# Altium project YuzukiNeko.PrjPcb
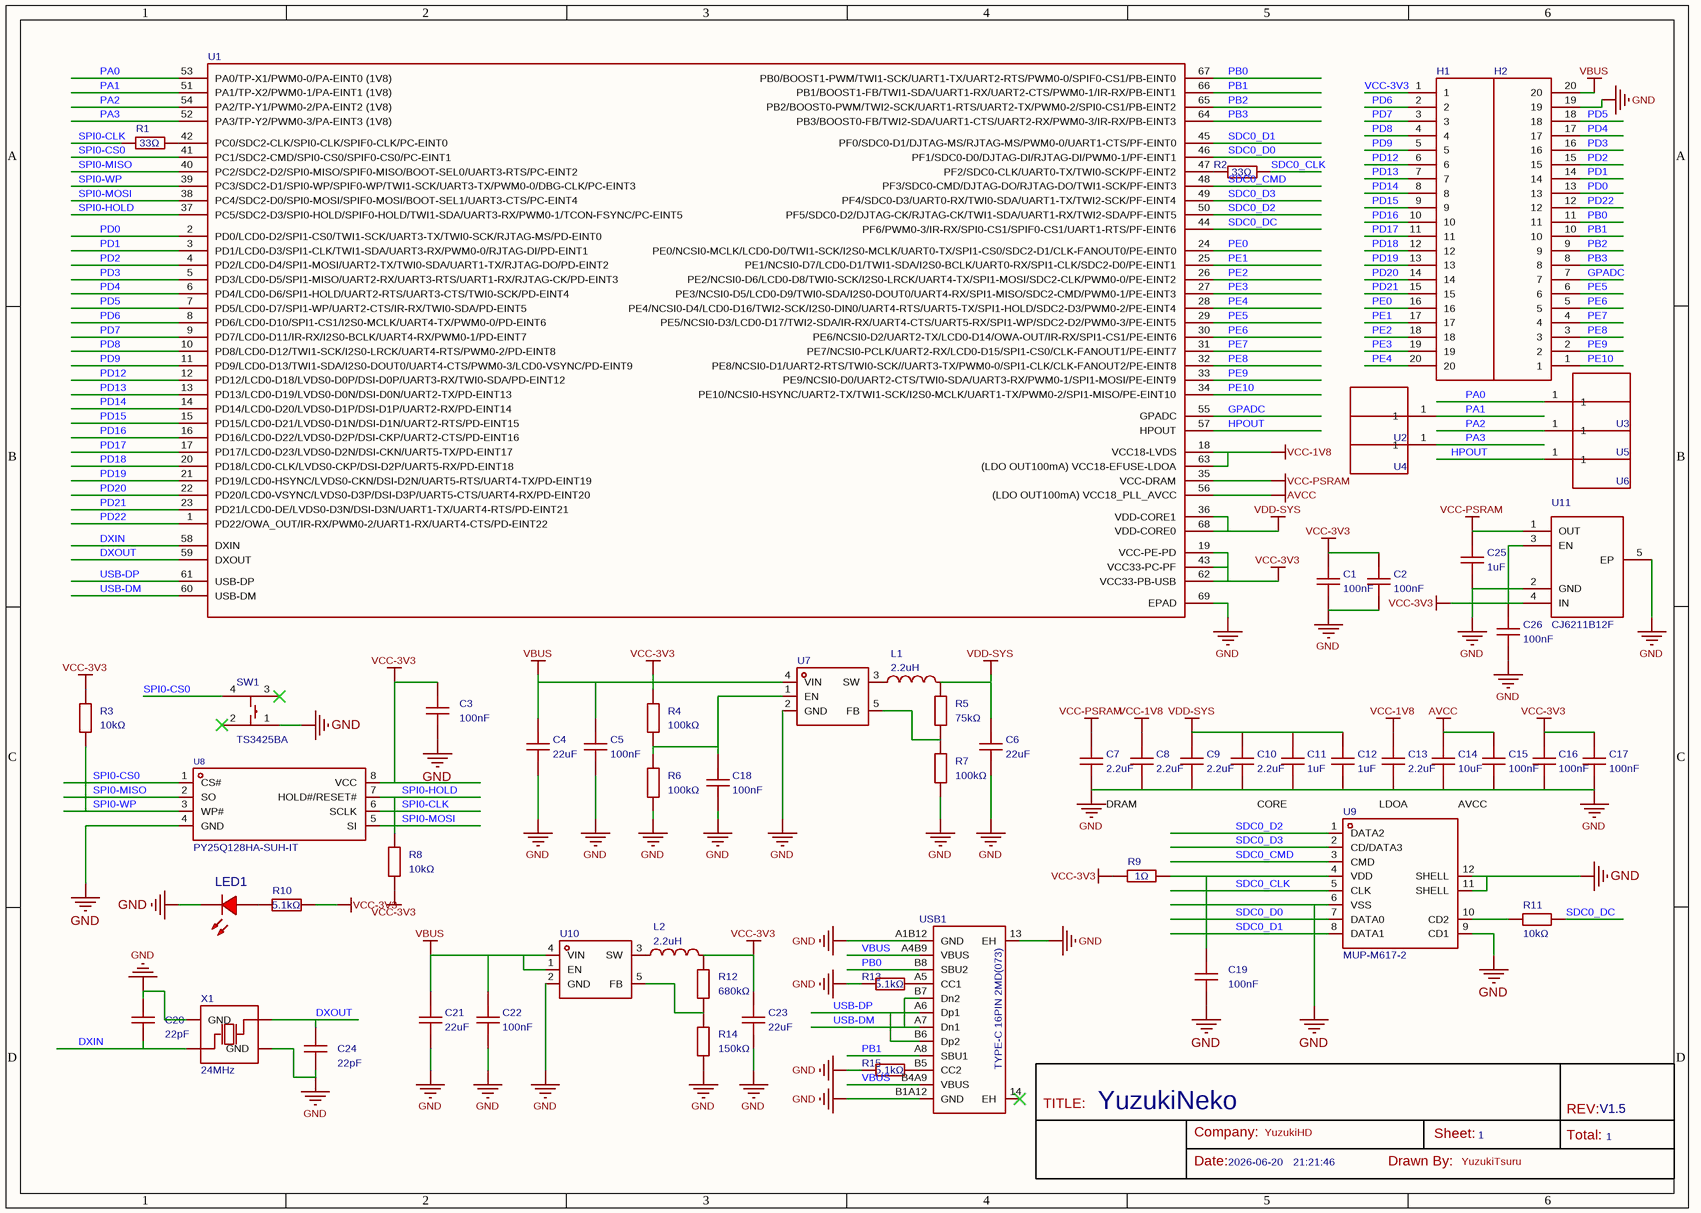
[diagram p0: P1.schdoc]
1 sheet, 60 parts. Net scope: global (net labels, ports and power ports of the same name join across sheets).
Board file: PCB1.pcbdoc

## Sheet P1.schdoc
size 297 x 212 mm; Symbol: Sheet_A4; Company: 嘉立创EDA; Version: V1.5; Page Size: A4; @Project Name: YuzukiNeko; @Update Date: 2026-06-20; @Create Date: 2026-04-19; Color: #000000; @Page Name: P1; @Page Count: 1; @Page No: 1; @Update Time: 21:21:46; Device: Sheet_A4; @Board Name: Board1; @Create Time: 20:09:08; @Schematic Name: Schematic1; @Assembly Variant: Basic; Border: 1; Title Block Position: 3; Size: A4; Width: 1170; Height: 825; Region Start: 1; X Region Count: 6; Y Region Count: 4; Blade Width: 10

### Parts
C1  100nF  [C0402-NSK]
C2  100nF  [C0402-NSK]
C3  100nF  [C0402-NSK]
C4  22uF  [C0603-NSK]
C5  100nF  [C0603-NSK]
C6  22uF  [C0603-NSK]
C7  2.2uF  [C0402-NSK]
C8  2.2uF  [C0402-NSK]
C9  2.2uF  [C0402-NSK]
C10  2.2uF  [C0402-NSK]
C11  1uF  [C0402-NSK]
C12  1uF  [C0402-NSK]
C13  2.2uF  [C0402-NSK]
C14  10uF  [C0402-NSK]
C15  100nF  [C0402-NSK]
C16  100nF  [C0402-NSK]
C17  100nF  [C0402-NSK]
C18  100nF  [C0603-NSK]
C19  100nF  [C0402-NSK]
C20  22pF  [C0402-NSK]
C21  22uF  [C0603-NSK]
C22  100nF  [C0603-NSK]
C23  22uF  [C0603-NSK]
C24  22pF  [C0402-NSK]
C25  1uF  [C0402-NSK]
C26  100nF  [C0402-NSK]
H1  (no value)  [2.54PHSM-1X20P]
H2  (no value)  [2.54PHSM-1X20P]
L1  value 2.2uH  [IND-SMD_L2.0-W1.6_1]
L2  value 2.2uH  [IND-SMD_L2.0-W1.6_1]
LED1  (no value)  [LED0603 NSK]
R1  33Ω  [R0402-NSK]
R2  33Ω  [R0402-NSK]
R3  10kΩ  [R0402-NSK]
R4  100kΩ  [R0402-NSK]
R5  75kΩ  [R0402-NSK]
R6  100kΩ  [R0402-NSK]
R7  100kΩ  [R0402-NSK]
R8  10kΩ  [R0402-NSK]
R9  1Ω  [R0402-NSK]
R10  5.1kΩ  [R0402-NSK]
R11  10kΩ  [R0402-NSK]
R12  680kΩ  [R0402-NSK]
R13  5.1kΩ  [R0402-NSK]
R14  150kΩ  [R0402-NSK]
R15  5.1kΩ  [R0402-NSK]
SW1  TS3425BA  [SW-SMD_4P-L4.2-W3.2-P2.15-LS4.6-1]
U1  (no value)  [QFN-68_L7.0-W7.0-P0.35-TL-EP4.5]
U2  (no value)  [PAD60]
U3  (no value)  [PAD60]
U4  (no value)  [PAD60]
U5  (no value)  [PAD60]
U6  (no value)  [PAD60]
U7  (no value)  [SOT-23-5_L3.0-W1.7-P0.95-LS2.8-BR]
U8  PY25Q128HA-SUH-IT  [SOP-8_L5.2-W5.3-P1.27-LS7.9-BL]
U9  MUP-M617-2  [TF-SMD_MUP-M617-2]
U10  (no value)  [SOT-23-5_L3.0-W1.7-P0.95-LS2.8-BR]
U11  CJ6211B12F  [UDFN-4_L1.0-W1.0-P0.65-BL-EP]
USB1  TYPE-C 16PIN 2MD(073)  [USB-C-SMD_TYPE-C-16PIN-2MD-073]
X1  24MHz  [osc-smd_4p-l2.0-w1.6-bl]

### Nets
AVCC: C14.2 C15.2 U1.56((LDO_OUT100mA)_VCC18_PLL_AVCC)
GND: C1.1 C2.1 C3.2 C4.1 C5.1 C6.1 C7.1 C8.1 C9.1 C10.1 C11.1 C12.1 C13.1 C14.1 C15.1 C16.1 C17.1 C18.1 C19.1 C20.2 C21.1 C22.1 C23.1 C24.1 C25.1 C26.1 H2.19 LED1.1(C) R6.1 R7.1 R13.1 R14.1 R15.1 SW1.1 U1.69(EPAD) U7.2(GND) U8.4(GND) U9.6(VSS) U9.9(CD1) U9.11(SHELL) U9.12(SHELL) U10.2(GND) U11.2(GND) U11.5(EP) USB1.13(EH) USB1.A1B12(GND) USB1.B1A12(GND) X1.2(GND) X1.4(GND)
VBUS: C4.2 C5.2 C21.2 C22.2 H2.20 U7.4(VIN) U10.1(EN) U10.4(VIN) USB1.A4B9(VBUS) USB1.B4A9(VBUS)
VCC-1V8: C8.2 C13.2 U1.18(VCC18-LVDS) U1.63((LDO_OUT100mA)_VCC18-EFUSE-LDOA)
VCC-3V3: C1.2 C2.2 C3.1 C16.2 C17.2 C23.2 C26.2 H1.1 L2.2 R3.2 R4.2 R8.1 R9.2 R10.2 R12.2 U1.19(VCC-PE-PD) U1.43(VCC33-PC-PF) U1.62(VCC33-PB-USB) U8.8(VCC) U11.3(EN) U11.4(IN)
VCC-PSRAM: C7.2 C25.2 U1.35(VCC-DRAM) U11.1(OUT)
VDD-SYS: C6.2 C9.2 C10.2 C11.2 C12.2 L1.2 R5.2 U1.36(VDD-CORE1) U1.68(VDD-CORE0)
DXIN: C20.1 U1.58(DXIN) X1.1(OSC1)
DXOUT: C24.2 U1.59(DXOUT) X1.3(OSC2)
GPADC: H2.7 U1.55(GPADC)
HPOUT: U1.57(HPOUT) U6.1
PA0: U1.53(PA0/TP-X1/PWM0-0/PA-EINT0_(1V8)) U3.1
PA1: U1.51(PA1/TP-X2/PWM0-1/PA-EINT1_(1V8)) U2.1
PA2: U1.54(PA2/TP-Y1/PWM0-2/PA-EINT2_(1V8)) U5.1
PA3: U1.52(PA3/TP-Y2/PWM0-3/PA-EINT3_(1V8)) U4.1
PB0: H2.11 U1.67(PB0/BOOST1-PWM/TWI1-SCK/UART1-TX/UART2-RTS/PWM0-0/SPIF0-CS1/PB-EINT0) USB1.B8(SBU2)
PB1: H2.10 U1.66(PB1/BOOST1-FB/TWI1-SDA/UART1-RX/UART2-CTS/PWM0-1/IR-RX/PB-EINT1) USB1.A8(SBU1)
PB2: H2.9 U1.65(PB2/BOOST0-PWM/TWI2-SCK/UART1-RTS/UART2-TX/PWM0-2/SPI0-CS1/PB-EINT2)
PB3: H2.8 U1.64(PB3/BOOST0-FB/TWI2-SDA/UART1-CTS/UART2-RX/PWM0-3/IR-RX/PB-EINT3)
PD0: H2.13 U1.2(PD0/LCD0-D2/SPI1-CS0/TWI1-SCK/UART3-TX/TWI0-SCK/RJTAG-MS/PD-EINT0)
PD1: H2.14 U1.3(PD1/LCD0-D3/SPI1-CLK/TWI1-SDA/UART3-RX/PWM0-0/RJTAG-DI/PD-EINT1)
PD2: H2.15 U1.4(PD2/LCD0-D4/SPI1-MOSI/UART2-TX/TWI0-SDA/UART1-TX/RJTAG-DO/PD-EINT2)
PD3: H2.16 U1.5(PD3/LCD0-D5/SPI1-MISO/UART2-RX/UART3-RTS/UART1-RX/RJTAG-CK/PD-EINT3)
PD4: H2.17 U1.6(PD4/LCD0-D6/SPI1-HOLD/UART2-RTS/UART3-CTS/TWI0-SCK/PD-EINT4)
PD5: H2.18 U1.7(PD5/LCD0-D7/SPI1-WP/UART2-CTS/IR-RX/TWI0-SDA/PD-EINT5)
PD6: H1.2 U1.8(PD6/LCD0-D10/SPI1-CS1/I2S0-MCLK/UART4-TX/PWM0-0/PD-EINT6)
PD7: H1.3 U1.9(PD7/LCD0-D11/IR-RX/I2S0-BCLK/UART4-RX/PWM0-1/PD-EINT7)
PD8: H1.4 U1.10(PD8/LCD0-D12/TWI1-SCK/I2S0-LRCK/UART4-RTS/PWM0-2/PD-EINT8)
PD9: H1.5 U1.11(PD9/LCD0-D13/TWI1-SDA/I2S0-DOUT0/UART4-CTS/PWM0-3/LCD0-VSYNC/PD-EINT9)
PD12: H1.6 U1.12(PD12/LCD0-D18/LVDS0-D0P/DSI-D0P/UART3-RX/TWI0-SDA/PD-EINT12)
PD13: H1.7 U1.13(PD13/LCD0-D19/LVDS0-D0N/DSI-D0N/UART2-TX/PD-EINT13)
PD14: H1.8 U1.14(PD14/LCD0-D20/LVDS0-D1P/DSI-D1P/UART2-RX/PD-EINT14)
PD15: H1.9 U1.15(PD15/LCD0-D21/LVDS0-D1N/DSI-D1N/UART2-RTS/PD-EINT15)
PD16: H1.10 U1.16(PD16/LCD0-D22/LVDS0-D2P/DSI-CKP/UART2-CTS/PD-EINT16)
PD17: H1.11 U1.17(PD17/LCD0-D23/LVDS0-D2N/DSI-CKN/UART5-TX/PD-EINT17)
PD18: H1.12 U1.20(PD18/LCD0-CLK/LVDS0-CKP/DSI-D2P/UART5-RX/PD-EINT18)
PD19: H1.13 U1.21(PD19/LCD0-HSYNC/LVDS0-CKN/DSI-D2N/UART5-RTS/UART4-TX/PD-EINT19)
PD20: H1.14 U1.22(PD20/LCD0-VSYNC/LVDS0-D3P/DSI-D3P/UART5-CTS/UART4-RX/PD-EINT20)
PD21: H1.15 U1.23(PD21/LCD0-DE/LVDS0-D3N/DSI-D3N/UART1-TX/UART4-RTS/PD-EINT21)
PD22: H2.12 U1.1(PD22/OWA_OUT/IR-RX/PWM0-2/UART1-RX/UART4-CTS/PD-EINT22)
PE0: H1.16 U1.24(PE0/NCSI0-MCLK/LCD0-D0/TWI1-SCK/I2S0-MCLK/UART0-TX/SPI1-CS0/SDC2-D1/CLK-FANOUT0/PE-EINT0)
PE1: H1.17 U1.25(PE1/NCSI0-D7/LCD0-D1/TWI1-SDA/I2S0-BCLK/UART0-RX/SPI1-CLK/SDC2-D0/PE-EINT1)
PE2: H1.18 U1.26(PE2/NCSI0-D6/LCD0-D8/TWI0-SCK/I2S0-LRCK/UART4-TX/SPI1-MOSI/SDC2-CLK/PWM0-0/PE-EINT2)
PE3: H1.19 U1.27(PE3/NCSI0-D5/LCD0-D9/TWI0-SDA/I2S0-DOUT0/UART4-RX/SPI1-MISO/SDC2-CMD/PWM0-1/PE-EINT3)
PE4: H1.20 U1.28(PE4/NCSI0-D4/LCD0-D16/TWI2-SCK/I2S0-DIN0/UART4-RTS/UART5-TX/SPI1-HOLD/SDC2-D3/PWM0-2/PE-EINT4)
PE5: H2.6 U1.29(PE5/NCSI0-D3/LCD0-D17/TWI2-SDA/IR-RX/UART4-CTS/UART5-RX/SPI1-WP/SDC2-D2/PWM0-3/PE-EINT5)
PE6: H2.5 U1.30(PE6/NCSI0-D2/UART2-TX/LCD0-D14/OWA-OUT/IR-RX/SPI1-CS1/PE-EINT6)
PE7: H2.4 U1.31(PE7/NCSI0-PCLK/UART2-RX/LCD0-D15/SPI1-CS0/CLK-FANOUT1/PE-EINT7)
PE8: H2.3 U1.32(PE8/NCSI0-D1/UART2-RTS/TWI0-SCK//UART3-TX/PWM0-0/SPI1-CLK/CLK-FANOUT2/PE-EINT8)
PE9: H2.2 U1.33(PE9/NCSI0-D0/UART2-CTS/TWI0-SDA/UART3-RX/PWM0-1/SPI1-MOSI/PE-EINT9)
PE10: H2.1 U1.34(PE10/NCSI0-HSYNC/UART2-TX/TWI1-SCK/I2S0-MCLK/UART1-TX/PWM0-2/SPI1-MISO/PE-EINT10)
SDC0_CLK: R2.2 U9.5(CLK)
SDC0_CMD: U1.48(PF3/SDC0-CMD/DJTAG-DO/RJTAG-DO/TWI1-SCK/PF-EINT3) U9.3(CMD)
SDC0_D0: U1.46(PF1/SDC0-D0/DJTAG-DI/RJTAG-DI/PWM0-1/PF-EINT1) U9.7(DATA0)
SDC0_D1: U1.45(PF0/SDC0-D1/DJTAG-MS/RJTAG-MS/PWM0-0/UART1-CTS/PF-EINT0) U9.8(DATA1)
SDC0_D2: U1.50(PF5/SDC0-D2/DJTAG-CK/RJTAG-CK/TWI1-SDA/UART1-RX/TWI2-SDA/PF-EINT5) U9.1(DATA2)
SDC0_D3: U1.49(PF4/SDC0-D3/UART0-RX/TWI0-SDA/UART1-TX/TWI2-SCK/PF-EINT4) U9.2(CD/DATA3)
SDC0_DC: R11.2 U1.44(PF6/PWM0-3/IR-RX/SPI0-CS1/SPIF0-CS1/UART1-RTS/PF-EINT6)
SPI0-CLK: R1.1 U8.6(SCLK)
SPI0-CS0: SW1.4 U1.41(PC1/SDC2-CMD/SPI0-CS0/SPIF0-CS0/PC-EINT1) U8.1(CS#)
SPI0-HOLD: R8.2 U1.37(PC5/SDC2-D3/SPI0-HOLD/SPIF0-HOLD/TWI1-SDA/UART3-RX/PWM0-1/TCON-FSYNC/PC-EINT5) U8.7(HOLD#/RESET#)
SPI0-MISO: U1.40(PC2/SDC2-D2/SPI0-MISO/SPIF0-MISO/BOOT-SEL0/UART3-RTS/PC-EINT2) U8.2(SO)
SPI0-MOSI: U1.38(PC4/SDC2-D0/SPI0-MOSI/SPIF0-MOSI/BOOT-SEL1/UART3-CTS/PC-EINT4) U8.5(SI)
SPI0-WP: R3.1 U1.39(PC3/SDC2-D1/SPI0-WP/SPIF0-WP/TWI1-SCK/UART3-TX/PWM0-0/DBG-CLK/PC-EINT3) U8.3(WP#)
USB-DM: U1.60(USB-DM) USB1.A7(Dn1) USB1.B7(Dn2)
USB-DP: U1.61(USB-DP) USB1.A6(Dp1) USB1.B6(Dp2)
NetC18_2: C18.2 R4.1 R6.2 U7.1(EN)
NetC19_2: C19.2 R9.1 U9.4(VDD)
NetL1_1: L1.1 U7.3(SW)
NetL2_1: L2.1 U10.3(SW)
NetLED1_2: LED1.2(A) R10.1
NetR1_2: R1.2 U1.42(PC0/SDC2-CLK/SPI0-CLK/SPIF0-CLK/PC-EINT0)
NetR2_1: R2.1 U1.47(PF2/SDC0-CLK/UART0-TX/TWI0-SCK/PF-EINT2)
NetR5_1: R5.1 R7.2 U7.5(FB)
NetR11_1: R11.1 U9.10(CD2)
NetR12_1: R12.1 R14.2 U10.5(FB)
NetR13_2: R13.2 USB1.A5(CC1)
NetR15_2: R15.2 USB1.B5(CC2)

Not connected (* = marked no-connect by the designer): SW1 2* 3*; USB1 14(EH)*

### Notes on the sheet
- DRAM
- CORE
- LDOA
- AVCC
- TITLE:
- YuzukiNeko
- Company:
- Date:
- 2026-06-20
- YuzukiHD
- 21:21:46
- Drawn By:
- Sheet:
- YuzukiTsuru
- 1
- Total:
- REV:
- V1.5

### Library data of the parts
C1 C2 C15-C17 = CL05B104KO5NNNC: 容值:100nF;精度:±10%;额定电压:16V;温度系数:X7R;; Manufacturer: SAMSUNG(三星); Symbol: Capacitance; 3D Model: 36a51122f27c49738f86b3bfa98863e00819f05c4eef4c71ace90d822a990e87; 3D Model Transform: 39.37,19.685,0,0,0,0,0,0,0; Add into BOM: yes; Tolerance: ±10%; Voltage Rating: 16V; Temperature Coefficient: X7R; ModelName: C0402_L1.0-W0.5-H0.5; Device: CL05B104KO5NNNC; Supplier Footprint: 0402; Value: 100nF; Convert to PCB: yes; LCSC Part Name: 100nF ±10% 16V; Supplier Part: C1525; Manufacturer Part: CL05B104KO5NNNC; JLCPCB Part Class: Basic Part; Datasheet: https://item.szlcsc.com/datasheet/CL05B104KO5NNNC/1877.html; Supplier: LCSC; FootprintName: C0402-NSK
C3 = CL03A104KQ3NNNC: 容值:100nF;精度:±10%;额定电压:6.3V;材质(温度系数):X5R;; Manufacturer: SAMSUNG(三星); 3D Model: e8033a7cb35143ffb28e3b81b2577ea0; 3D Model Transform: 23.622,11.811,0,0,0,0,0,0,0; Tolerance: ±10%; Voltage Rated: 6.3V; Temperature Coefficient: X5R; AddInBom: yes; ModelName: C0201_L0.6-W0.3-H0.3; Symbol: CL03A104KQ3NNNC; Device: CL03A104KQ3NNNC; LCSC Part Name: 100nF ±10% 6.3V; Supplier Part: C160831; Manufacturer Part: CL03A104KQ3NNNC; Supplier Footprint: 0201; JLCPCB Part Class: Extended Part; Datasheet: https://atta.szlcsc.com/upload/public/pdf/source/20171228/C163510_15144412327381213809.pdf; Supplier: LCSC; Value: 100nF; ConvertToPcb: yes; FootprintName: C0402-NSK
C4 C6 C21 C23 = CL10A226MQ8NRNC: 容值:22uF;精度:±20%;额定电压:6.3V;温度系数:X5R;; Manufacturer: SAMSUNG(三星); Symbol: Capacitance; Add into BOM: yes; 3D Model: ac125912035d415993ca9572d50418b1; 3D Model Transform: 62.992,31.496,0,0,0,0,0,0,0; Tolerance: ±20%; Voltage Rating: 6.3V; Temperature Coefficient: X5R; ModelName: C0603_L1.6-W0.8-H0.8; Device: CL10A226MQ8NRNC; Convert to PCB: yes; Value: 22uF; Supplier Footprint: 0603; LCSC Part Name: 22uF ±20% 6.3V; Supplier Part: C59461; Manufacturer Part: CL10A226MQ8NRNC; JLCPCB Part Class: Basic Part; Datasheet: https://item.szlcsc.com/datasheet/CL10A226MQ8NRNC/60514.html; Supplier: LCSC; FootprintName: C0603-NSK
C5 C18 C22 = CC0603KRX7R9BB104: 容值:100nF;精度:±10%;额定电压:50V;温度系数:X7R;; Manufacturer: YAGEO(国巨); Symbol: Capacitance; Add into BOM: yes; 3D Model: ac125912035d415993ca9572d50418b1; 3D Model Transform: 62.992,31.496,0,0,0,0,0,0,0; Tolerance: ±10%; Voltage Rating: 50V; Temperature Coefficient: X7R; ModelName: C0603_L1.6-W0.8-H0.8; Device: CC0603KRX7R9BB104; Convert to PCB: yes; Value: 100nF; Supplier Footprint: 0603; LCSC Part Name: 100nF ±10% 50V; Supplier Part: C14663; Manufacturer Part: CC0603KRX7R9BB104; JLCPCB Part Class: Basic Part; Datasheet: https://item.szlcsc.com/datasheet/CC0603KRX7R9BB104/15331.html; Supplier: LCSC; FootprintName: C0603-NSK
C7-C10 C13 = CL05A225MQ5NSNC: 容值:2.2uF;精度:±20%;额定电压:6.3V;温度系数:X5R;; Manufacturer: SAMSUNG(三星); Symbol: Capacitance; 3D Model: 36a51122f27c49738f86b3bfa98863e00819f05c4eef4c71ace90d822a990e87; 3D Model Transform: 39.37,19.685,0,0,0,0,0,0,0; Add into BOM: yes; Tolerance: ±20%; Voltage Rating: 6.3V; Temperature Coefficient: X5R; ModelName: C0402_L1.0-W0.5-H0.5; Device: CL05A225MQ5NSNC; Supplier Footprint: 0402; Value: 2.2uF; Convert to PCB: yes; LCSC Part Name: 2.2uF ±20% 6.3V; Supplier Part: C12530; Manufacturer Part: CL05A225MQ5NSNC; JLCPCB Part Class: Basic Part; Datasheet: https://item.szlcsc.com/datasheet/CL05A225MQ5NSNC/13164.html; Supplier: LCSC; FootprintName: C0402-NSK
C11 C12 = CL05A105KA5NQNC: 容值:1uF;精度:±10%;额定电压:25V;温度系数:X5R;; Manufacturer: SAMSUNG(三星); Symbol: Capacitance; 3D Model: 36a51122f27c49738f86b3bfa98863e00819f05c4eef4c71ace90d822a990e87; 3D Model Transform: 39.37,19.685,0,0,0,0,0,0,0; Add into BOM: yes; Tolerance: ±10%; Voltage Rating: 25V; Temperature Coefficient: X5R; ModelName: C0402_L1.0-W0.5-H0.5; Device: CL05A105KA5NQNC; Supplier Footprint: 0402; Value: 1uF; Convert to PCB: yes; LCSC Part Name: 1uF ±10% 25V; Supplier Part: C52923; Manufacturer Part: CL05A105KA5NQNC; JLCPCB Part Class: Basic Part; Datasheet: https://item.szlcsc.com/datasheet/CL05A105KA5NQNC/53938.html; Supplier: LCSC; FootprintName: C0402-NSK
C14 = CL05A106MQ5NUNC: 容值:10uF;精度:±20%;额定电压:6.3V;温度系数:X5R;; Manufacturer: SAMSUNG(三星); Symbol: Capacitance; 3D Model: 36a51122f27c49738f86b3bfa98863e00819f05c4eef4c71ace90d822a990e87; 3D Model Transform: 39.37,19.685,0,0,0,0,0,0,0; Add into BOM: yes; Tolerance: ±20%; Voltage Rating: 6.3V; Temperature Coefficient: X5R; ModelName: C0402_L1.0-W0.5-H0.5; Device: CL05A106MQ5NUNC; Supplier Footprint: 0402; Value: 10uF; Convert to PCB: yes; LCSC Part Name: 10uF ±20% 6.3V; Supplier Part: C15525; Manufacturer Part: CL05A106MQ5NUNC; JLCPCB Part Class: Basic Part; Datasheet: https://item.szlcsc.com/datasheet/CL05A106MQ5NUNC/16204.html; Supplier: LCSC; FootprintName: C0402-NSK
C19 = CL05B104KO5NNNC: 容值:100nF;精度:±10%;额定电压:16V;温度系数:X7R;; Manufacturer: SAMSUNG(三星); Symbol: Capacitance; 3D Model: 36a51122f27c49738f86b3bfa98863e0; 3D Model Transform: 39.37,19.685,0,0,0,0,0,0,0; Add into BOM: yes; Tolerance: ±10%; Voltage Rating: 16V; Temperature Coefficient: X7R; ModelName: C0402_L1.0-W0.5-H0.5; Device: CL05B104KO5NNNC; Supplier Footprint: 0402; Value: 100nF; Convert to PCB: yes; LCSC Part Name: 100nF ±10% 16V; Supplier Part: C1525; Manufacturer Part: CL05B104KO5NNNC; JLCPCB Part Class: Basic Part; Datasheet: https://item.szlcsc.com/datasheet/CL05B104KO5NNNC/1877.html; Supplier: LCSC; FootprintName: C0402-NSK
C20 C24 = 0402CG220J500NT: 容值:22pF;精度:±5%;额定电压:50V;温度系数:C0G;; Manufacturer: FH(风华); Add into BOM: yes; 3D Model: 36a51122f27c49738f86b3bfa98863e0; 3D Model Transform: 39.37,19.685,0,0,0,0,0,0,0; Tolerance: ±5%; Voltage Rating: 50V; Temperature Coefficient: C0G; ModelName: C0402_L1.0-W0.5-H0.5; Symbol: 0402CG220J500NT; Device: 0402CG220J500NT; Convert to PCB: yes; Supplier Footprint: 0402; Value: 22pF; LCSC Part Name: 22pF ±5% 50V; Supplier Part: C1555; Manufacturer Part: 0402CG220J500NT; JLCPCB Part Class: Basic Part; Datasheet: https://item.szlcsc.com/datasheet/0402CG220J500NT/1907.html; Supplier: LCSC; FootprintName: C0402-NSK
C25 = CL05A105KA5NQNC: 容值:1uF;精度:±10%;额定电压:25V;温度系数:X5R;; Manufacturer: SAMSUNG(三星); Symbol: Capacitance; Add into BOM: yes; 3D Model: 36a51122f27c49738f86b3bfa98863e00819f05c4eef4c71ace90d822a990e87; 3D Model Transform: 39.37,19.685,0,0,0,0,0,0,0; Tolerance: ±10%; Voltage Rating: 25V; Temperature Coefficient: X5R; ModelName: C0402_L1.0-W0.5-H0.5; Device: CL05A105KA5NQNC; Convert to PCB: yes; Supplier Footprint: 0402; Value: 1uF; LCSC Part Name: 1uF ±10% 25V; Supplier Part: C52923; Manufacturer Part: CL05A105KA5NQNC; JLCPCB Part Class: Basic Part; Datasheet: https://item.szlcsc.com/datasheet/CL05A105KA5NQNC/53938.html; Supplier: LCSC; FootprintName: C0402-NSK
C26 = CL05B104KO5NNNC: 容值:100nF;精度:±10%;额定电压:16V;温度系数:X7R;; Manufacturer: SAMSUNG(三星); Symbol: Capacitance; Add into BOM: yes; 3D Model: 36a51122f27c49738f86b3bfa98863e00819f05c4eef4c71ace90d822a990e87; 3D Model Transform: 39.37,19.685,0,0,0,0,0,0,0; Tolerance: ±10%; Voltage Rating: 16V; Temperature Coefficient: X7R; ModelName: C0402_L1.0-W0.5-H0.5; Device: CL05B104KO5NNNC; Convert to PCB: yes; Supplier Footprint: 0402; Value: 100nF; LCSC Part Name: 100nF ±10% 16V; Supplier Part: C1525; Manufacturer Part: CL05B104KO5NNNC; JLCPCB Part Class: Basic Part; Datasheet: https://item.szlcsc.com/datasheet/CL05B104KO5NNNC/1877.html; Supplier: LCSC; FootprintName: C0402-NSK
H1 H2 = 2.54PHSM-1X20P: Manufacturer: kinghelm(金航标); ManufacturerPart: KH-2.54PH180-1X16P-L11.5; Symbol: 2.54PHSM-1X19P; AddInBom: yes; Device: 2.54PHSM-1X20P; Supplier: LCSC; SupplierPart: C2905491; ConvertToPcb: yes; FootprintName: 2.54PHSM-1X20P
L1 L2 = CKCS201610-2.2uH/M: 电感值:2.2uH;精度:±20%;额定电流:1.1A;直流电阻(DCR):264mΩ;; Manufacturer: CENKER(岑科); Symbol: CKCS201610-2.2UH/M-N; 3D Model: b394e7fcf39b47c8917c782d9e6cbcf8; 3D Model Transform: 62.992,79.527,0,90,0,0,0,0,0; Tolerance: ±20%; Rated Current: 1.1A; DC Resistance (DCR): 264mΩ; AddInBom: yes; ModelName: IND-SMD_L2.0-W1.6-H1.1; Device: CKCS201610-2.2uH/M; LCSC Part Name: 2.2uH ±20% 1.1A 264mΩ; Supplier Part: C354533; Manufacturer Part: CKCS201610-2.2uH/M; LCSC On Sale: 1; Supplier Footprint: SMD; JLCPCB Part Class: Extended Part; JLCPCB On Sale: 1; Datasheet: https://atta.szlcsc.com/upload/public/pdf/source/20190315/C354533_59121B22FE01331804674A67C9C7C2C4.pdf; Supplier: LCSC; ConvertToPcb: yes; FootprintName: IND-SMD_L2.0-W1.6_1
LED1 = LED_0603-R: Symbol: LED_R; Convert to PCB: yes; 3D Model: dd8257b0d61a4cd7b68939a056e080950819f05c4eef4c71ace90d822a990e87; 3D Model Transform: 58.72,29.4,22.03,0,0,0,0,0,0; Devices: []; ModelName: LED-0603_R; Device: LED_0603-R; Add into BOM: yes; Supplier Footprint: 0603; Footprints: []; FootprintName: LED0603 NSK; Symbols: []
R1 = 0402WGF330JTCE: 电阻类型:厚膜电阻;阻值:33Ω;精度:±1%;功率:62.5mW;工作电压:50V;温度系数:±100ppm/℃;; Manufacturer: UNI-ROYAL(厚声); Symbol: 电阻; Add into BOM: yes; Tolerance: ±1%; Power(Watts): 62.5mW; Voltage-Supply(Max): 50V; ModelId: 98c88bc2b9094f218f3a3e30a70127380819f05c4eef4c71ace90d822a990e87; ModelName: R0402_L1.0-W0.5-H0.4; ModelTransform: 39.37,19.685,0,0,0,0,0,0,0; Device: 0402WGF330JTCE; Value: 33Ω; Convert to PCB: yes; LCSC Part Name: 33Ω ±1% 62.5mW 厚膜电阻; Supplier Part: C25105; Manufacturer Part: 0402WGF330JTCE; JLCPCB Part Class: Basic Part; Datasheet: https://item.szlcsc.com/datasheet/0402WGF330JTCE/25848.html; Supplier: LCSC; Type: 厚膜电阻; Temperature Coefficient: ±100ppm/℃; Operating Temperature: -55℃~+155℃; Supplier Footprint: 0402; FootprintName: R0402-NSK
R2 = 0402WGF330JTCE: 电阻类型:厚膜电阻;阻值:33Ω;精度:±1%;功率:62.5mW;工作电压:50V;温度系数:±100ppm/℃;; Manufacturer: UNI-ROYAL(厚声); Symbol: 电阻; 3D Model: 98c88bc2b9094f218f3a3e30a70127380819f05c4eef4c71ace90d822a990e87; 3D Model Transform: 39.37,19.685,0,0,0,0,0,0,0; Add into BOM: yes; Tolerance: ±1%; Power(Watts): 62.5mW; Voltage-Supply(Max): 50V; ModelName: R0402_L1.0-W0.5-H0.4; Device: 0402WGF330JTCE; Value: 33Ω; Supplier Footprint: 0402; Convert to PCB: yes; LCSC Part Name: 33Ω ±1% 62.5mW 厚膜电阻; Supplier Part: C25105; Manufacturer Part: 0402WGF330JTCE; JLCPCB Part Class: Basic Part; Datasheet: https://item.szlcsc.com/datasheet/0402WGF330JTCE/25848.html; Supplier: LCSC; Type: 厚膜电阻; Temperature Coefficient: ±100ppm/℃; Operating Temperature: -55℃~+155℃; FootprintName: R0402-NSK
R3 R8 R11 = 0402WGF1002TCE: 电阻类型:厚膜电阻;阻值:10kΩ;精度:±1%;功率:62.5mW;工作电压:50V;温度系数:±100ppm/℃;; Manufacturer: UNI-ROYAL(厚声); Symbol: 电阻; 3D Model: 0e006ba4c37b4b73b0e85d5d1c6800cb; 3D Model Transform: 39.37,19.685,0,0,0,0,0,0,0; Add into BOM: yes; Tolerance: ±1%; Power(Watts): 62.5mW; Voltage-Supply(Max): 50V; ModelName: R0402_L1.0-W0.5-H0.4; Device: 0402WGF1002TCE; Supplier Footprint: 0402; Value: 10kΩ; Convert to PCB: yes; LCSC Part Name: 10kΩ ±1% 62.5mW 厚膜电阻; Supplier Part: C25744; Manufacturer Part: 0402WGF1002TCE; JLCPCB Part Class: Basic Part; Datasheet: https://item.szlcsc.com/datasheet/0402WGF1002TCE/26487.html; Supplier: LCSC; Type: 厚膜电阻; Temperature Coefficient: ±100ppm/℃; Operating Temperature: -55℃~+155℃; FootprintName: R0402-NSK
R4 R6 R7 = 0402WGF1003TCE: 电阻类型:厚膜电阻;阻值:100kΩ;精度:±1%;功率:62.5mW;工作电压:50V;温度系数:±100ppm/℃;; Manufacturer: UNI-ROYAL(厚声); Symbol: 电阻; Add into BOM: yes; 3D Model: 98c88bc2b9094f218f3a3e30a70127380819f05c4eef4c71ace90d822a990e87; 3D Model Transform: 39.37,19.685,0,0,0,0,0,0,0; Tolerance: ±1%; Power(Watts): 62.5mW; Voltage-Supply(Max): 50V; ModelName: R0402_L1.0-W0.5-H0.4; Device: 0402WGF1003TCE; Convert to PCB: yes; Supplier Footprint: 0402; Value: 100kΩ; LCSC Part Name: 100kΩ ±1% 62.5mW 厚膜电阻; Supplier Part: C25741; Manufacturer Part: 0402WGF1003TCE; JLCPCB Part Class: Basic Part; Datasheet: https://item.szlcsc.com/datasheet/0402WGF1003TCE/26484.html; Supplier: LCSC; Type: 厚膜电阻; Temperature Coefficient: ±100ppm/℃; Operating Temperature: -55℃~+155℃; FootprintName: R0402-NSK
R5 = FRC0402J753 TS: 电阻类型:厚膜电阻;阻值:75kΩ;精度:±5%;功率:62.5mW;工作电压:50V;温度系数:±100ppm/℃;; Manufacturer: FOJAN(富捷); Symbol: 电阻; Add into BOM: yes; 3D Model: 98c88bc2b9094f218f3a3e30a70127380819f05c4eef4c71ace90d822a990e87; 3D Model Transform: 39.37,19.685,0,0,0,0,0,0,0; Tolerance: ±5%; Power(Watts): 62.5mW; Voltage-Supply(Max): 50V; ModelName: R0402_L1.0-W0.5-H0.4; Device: FRC0402J753 TS; Convert to PCB: yes; Supplier Footprint: 0402; Value: 75kΩ; LCSC Part Name: 75kΩ ±5% 62.5mW 厚膜电阻; Supplier Part: C2906965; Manufacturer Part: FRC0402J753 TS; JLCPCB Part Class: Extended Part; Datasheet: https://item.szlcsc.com/datasheet/FRC0402J753%2520TS/3180478.html; Supplier: LCSC; Type: 厚膜电阻; Temperature Coefficient: ±100ppm/℃; Operating Temperature: -55℃~+155℃; FootprintName: R0402-NSK
R9 = 0402WGF100KTCE: 电阻类型:厚膜电阻;阻值:1Ω;精度:±1%;功率:62.5mW;工作电压:50V;温度系数:±200ppm/℃;; Manufacturer: UNI-ROYAL(厚声); Symbol: 电阻; 3D Model: 671aefced39d4c318694bba8bd8efd39; 3D Model Transform: 39.37,19.685,0,0,0,0,0,0,0; Add into BOM: yes; Tolerance: ±1%; Power(Watts): 62.5mW; Voltage-Supply(Max): 50V; ModelName: R0402_L1.0-W0.5-H0.4; Device: 0402WGF100KTCE; Value: 1Ω; Supplier Footprint: 0402; Convert to PCB: yes; LCSC Part Name: 1Ω ±1% 62.5mW 厚膜电阻; Supplier Part: C25086; Manufacturer Part: 0402WGF100KTCE; JLCPCB Part Class: Extended Part; Datasheet: https://item.szlcsc.com/datasheet/0402WGF100KTCE/25829.html; Supplier: LCSC; Type: 厚膜电阻; Temperature Coefficient: ±200ppm/℃; Operating Temperature: -55℃~+155℃; FootprintName: R0402-NSK
R10 = 0402WGF5101TCE: 电阻类型:厚膜电阻;阻值:5.1kΩ;精度:±1%;功率:62.5mW;工作电压:50V;温度系数:±100ppm/℃;; Manufacturer: UNI-ROYAL(厚声); Symbol: 电阻; Add into BOM: yes; 3D Model: 0e006ba4c37b4b73b0e85d5d1c6800cb; 3D Model Transform: 39.37,19.685,0,0,0,0,0,0,0; Tolerance: ±1%; Power(Watts): 62.5mW; Voltage-Supply(Max): 50V; ModelName: R0402_L1.0-W0.5-H0.4; Device: 0402WGF5101TCE; Convert to PCB: yes; Value: 5.1kΩ; Supplier Footprint: 0402; LCSC Part Name: 5.1kΩ ±1% 62.5mW 厚膜电阻; Supplier Part: C25905; Manufacturer Part: 0402WGF5101TCE; JLCPCB Part Class: Basic Part; Datasheet: https://item.szlcsc.com/datasheet/0402WGF5101TCE/26648.html; Supplier: LCSC; Type: 厚膜电阻; Temperature Coefficient: ±100ppm/℃; Operating Temperature: -55℃~+155℃; FootprintName: R0402-NSK
R12 = FRC0402F6803TS: 电阻类型:厚膜电阻;阻值:680kΩ;精度:±1%;功率:62.5mW;工作电压:50V;温度系数:±100ppm/℃;; Manufacturer: FOJAN(富捷); Symbol: 电阻; Add into BOM: yes; 3D Model: 98c88bc2b9094f218f3a3e30a70127380819f05c4eef4c71ace90d822a990e87; 3D Model Transform: 39.37,19.685,0,0,0,0,0,0,0; Tolerance: ±1%; Power(Watts): 62.5mW; Voltage-Supply(Max): 50V; ModelName: R0402_L1.0-W0.5-H0.4; Device: FRC0402F6803TS; Convert to PCB: yes; Supplier Footprint: 0402; Value: 680kΩ; LCSC Part Name: 680kΩ ±1% 62.5mW 厚膜电阻; Supplier Part: C2909377; Manufacturer Part: FRC0402F6803TS; JLCPCB Part Class: Extended Part; Supplier: LCSC; Type: 厚膜电阻; Temperature Coefficient: ±100ppm/℃; Operating Temperature: -55℃~+155℃; FootprintName: R0402-NSK
R13 R15 = 0402WGF5101TCE: 电阻类型:厚膜电阻;阻值:5.1kΩ;精度:±1%;功率:62.5mW;工作电压:50V;温度系数:±100ppm/℃;; Manufacturer: UNI-ROYAL(厚声); Symbol: 电阻; 3D Model: 0e006ba4c37b4b73b0e85d5d1c6800cb; 3D Model Transform: 39.37,19.685,0,0,0,0,0,0,0; Add into BOM: yes; Tolerance: ±1%; Power(Watts): 62.5mW; Voltage-Supply(Max): 50V; ModelName: R0402_L1.0-W0.5-H0.4; Device: 0402WGF5101TCE; Value: 5.1kΩ; Supplier Footprint: 0402; Convert to PCB: yes; LCSC Part Name: 5.1kΩ ±1% 62.5mW 厚膜电阻; Supplier Part: C25905; Manufacturer Part: 0402WGF5101TCE; JLCPCB Part Class: Basic Part; Datasheet: https://item.szlcsc.com/datasheet/0402WGF5101TCE/26648.html; Supplier: LCSC; Type: 厚膜电阻; Temperature Coefficient: ±100ppm/℃; Operating Temperature: -55℃~+155℃; FootprintName: R0402-NSK
R14 = FRC0402F1503TS: 电阻类型:厚膜电阻;阻值:150kΩ;精度:±1%;功率:62.5mW;工作电压:50V;温度系数:±100ppm/℃;; Manufacturer: FOJAN(富捷); Symbol: 电阻; Add into BOM: yes; 3D Model: 98c88bc2b9094f218f3a3e30a70127380819f05c4eef4c71ace90d822a990e87; 3D Model Transform: 39.37,19.685,0,0,0,0,0,0,0; Tolerance: ±1%; Power(Watts): 62.5mW; Voltage-Supply(Max): 50V; ModelName: R0402_L1.0-W0.5-H0.4; Device: FRC0402F1503TS; Convert to PCB: yes; Supplier Footprint: 0402; Value: 150kΩ; LCSC Part Name: 150kΩ ±1% 62.5mW 厚膜电阻; Supplier Part: C2909320; Manufacturer Part: FRC0402F1503TS; JLCPCB Part Class: Extended Part; Supplier: LCSC; Type: 厚膜电阻; Temperature Coefficient: ±100ppm/℃; Operating Temperature: -55℃~+155℃; FootprintName: R0402-NSK
SW1 = TS3425BA: 电路结构:单刀单掷;按钮形状:椭圆形按钮;作用力:250gf;安装方式:立贴;开关长度:4.2mm;开关宽度:3.2mm;开关高度:2.5mm;带支架:不带;触点电流:50mA;额定电压(DC):12V;绝缘电阻:100MΩ;机械寿命:10万次;; Manufacturer: SHOU HAN(首韩); 3D Model: 6ea2d30f02094c0382f9882d02adbb83; 3D Model Transform: 183.0705,129.92139,0,0,0,0,0,0,0; Circuit: 单刀单掷; Actuator Style: 椭圆形按钮; Operating Force: 250gf; Switch Length: 4.2mm; Switch Width: 3.2mm; Switch Height: 2.5mm; Strike Gundam: 不带; Contact Current: 50mA; Voltage Rating (DC): 12V; Insulation Resistance: 100MΩ; Actuator/Cap Color: 白色; Pin Style: J型引脚; Mechanical Life: 10万次; AddInBom: yes; Symbol: TS3425BA; Device: TS3425BA; LCSC Part Name: 4.2*3.2*2.5mm 立贴 轻触开关; Supplier Part: C2681476; Manufacturer Part: TS3425BA; Supplier Footprint: SMD; JLCPCB Part Class: 扩展库; Datasheet: https://atta.szlcsc.com/upload/public/pdf/source/20210107/C2681476_BF217B2301F0070AA49504CB0BFDE895.pdf; Supplier: LCSC; Mounting Style: 立贴; Operating Temperature: -20℃~+85℃; ConvertToPcb: yes; FootprintName: SW-SMD_4P-L4.2-W3.2-P2.15-LS4.6-1; ModelName: SW-SMD_4P-L4.2-W3.2-P2.15-LS4.6-1
U1 = F101: AddInBom: yes; ModelId: f133f686dbbc4c2a801de1546189e2110819f05c4eef4c71ace90d822a990e87; ModelTransform: 276.3773992490768,276.3773992490768,30.70859960693866,0,0,0,0,0,0; Symbol: F101; Device: F101; FootprintName: QFN-68_L7.0-W7.0-P0.35-TL-EP4.5; ConvertToPcb: yes; ModelName: QFN-68_L7.0-W7.0-P0.35-TL-EP4.5
U2-U6 = PAD60: AddInBom: yes; Symbol: PAD60; Device: PAD60; ConvertToPcb: yes; FootprintName: PAD60
U7 U10 = MT3520B: Manufacturer: 西安航天民芯; Pin Type: IN; 3D Model: 8842b967607c425db77b95059c9337d3b0afbd003e064ab9ae6681619084b673; 3D Model Transform: 116,112,46,90,0,0,0,0,0; AddInBom: yes; ModelName: SOT-23-5_L2.9-W1.6-P0.95-LS2.8-TL; Symbol: MT3520B; Device: MT3520B; Supplier: LCSC; Supplier Part: C2684933; Manufacturer Part: MT3520B; JLCPCB Part Class: Extended Part; ConvertToPcb: yes; FootprintName: SOT-23-5_L3.0-W1.7-P0.95-LS2.8-BR
U8 = PY25Q128HA-SUH-IT: Manufacturer: PUYA(普冉); 3D Model: f5bb1e94e2594ee9a336e11deed3d015; 3D Model Transform: 205.905,311.023,0,0,0,0,0,0,0; AddInBom: yes; Symbol: PY25Q128HA-SUH-IT; Device: PY25Q128HA-SUH-IT; LCSC Part Name: PY25Q128HA-SUH-IT; Supplier Part: C7419750; Manufacturer Part: PY25Q128HA-SUH-IT; Supplier Footprint: SOP-8; JLCPCB Part Class: 扩展库; Supplier: LCSC; ConvertToPcb: yes; FootprintName: SOP-8_L5.2-W5.3-P1.27-LS7.9-BL; ModelName: SOP-8_L5.2-W5.3-P1.27-LS7.9-BL
U9 = MUP-M617-2: 卡类型:MicroSD卡(TF卡);连接器类型:卡座;本体最大高度:2.6mm;; Manufacturer: MUP(德海威); Connector Type: 卡座; Maximum Body Height: 2.6mm; 3D Model: fb228f8f423e4ea4ac8fb146064baca0; 3D Model Transform: 474.4085,216.9287,0,0,0,0,0,20.039,-27.559; AddInBom: yes; Symbol: MUP-M617-2; Device: MUP-M617-2; LCSC Part Name: MicroSD卡(TF卡) 卡座; Supplier Part: C5205359; Manufacturer Part: MUP-M617-2; Supplier Footprint: SMD; JLCPCB Part Class: 扩展库; Datasheet: https://atta.szlcsc.com/upload/public/pdf/source/20221020/4B0355AF259603421FB1BB81F444530F.pdf; Supplier: LCSC; Card Type: MicroSD卡(TF卡); ConvertToPcb: yes; FootprintName: TF-SMD_MUP-M617-2; ModelName: TF-SMD_MUP-M617-2
U11 = NCP114AMX280TCG: 输出类型:固定;输出极性:正;最大输入电压:5.5V;输出电压:2.8V;输出电流:300mA;电源纹波抑制比(PSRR):75dB@(1kHz);; Manufacturer: CJ(江苏长电/长晶); 3D Model: c1a489df884542e2aa77aee3d93f92e3; 3D Model Transform: 40.1574,40.1574,0,0,0,0,0,0,0; Output Type: 固定; Output Polarity: 正; Number of Outputs: 1; Maximum Input Voltage: 5.5V; Output Voltage: 2.8V; Dropout Voltage: 230mV@(300mA); Output Current: 300mA; AddInBom: yes; ModelName: UDFN-4_L1.0-W1.0-H0.6-P0.65-BL-EP; Symbol: NCP114AMX280TCG; Device: NCP114AMX280TCG; Supplier Part: C2992031; Manufacturer Part: CJ6211B12F; LCSC Part Name: LDO 稳压器，300 mA，高 PSRR; Supplier Footprint: DFN-4-EP(1x1); JLCPCB Part Class: Extended Part; Datasheet: https://atta.szlcsc.com/upload/public/pdf/source/20171026/C133054_15089839809491058833.PDF; Supplier: LCSC; Power Supply Rejection Ratio (PSRR): 75dB@(1kHz); ConvertToPcb: yes; FootprintName: UDFN-4_L1.0-W1.0-P0.65-BL-EP
USB1 = TYPE-C 16PIN 2MD(073): 连接器类型:Type-C;协议标准:-;公母:母;安装方式:卧贴;触点数量:16P;端口数量:1;额定电流 - 电源:3A;工作温度:-25℃~+85℃;; Manufacturer: SHOU HAN(首韩); AddInBom: yes; ModelId: 3a41b9ec9b654a0fad4d118405ec6290; ModelName: USB-C-SMD_TYPE-C-6PIN-2MD-073; ModelTransform: 351.9678,298.4246,0,0,0,0,0,-47.244,-35.433; Gender: 母; Number of Contacts: 16P; Number of Ports: 1; Current Rating-Power: 3A; Voltage Rating: 5V; Connect-Disconnect Life: 1万次; Detection color: 黑色; Symbol: TYPE-C 16PIN 2MD(073); Device: TYPE-C 16PIN 2MD(073); LCSC Part Name: Type-C 母 卧贴; SupplierPart: C2765186; ManufacturerPart: TYPE-C 16PIN 2MD(073); Supplier Footprint: SMD; JLCPCB Part Class: Extended Part; Datasheet: https://item.szlcsc.com/datasheet/TYPE-C%252016PIN%25202MD(073)/2901843.html; Supplier: LCSC; ConvertToPcb: yes; FootprintName: USB-C-SMD_TYPE-C-16PIN-2MD-073; Connector Type: Type-C; Protocol Standard: -; Mounting Type: 卧贴; Supplementary Features: -; Center Height: -; Length: -; Operating Temperature: -25℃~+85℃
X1 = XL7EL89CKI-111YLC-24M: 晶振类型:贴片晶振;频率:24MHz;常温频差:±10ppm;负载电容:8pF;频率稳定度:±20ppm;; Manufacturer: YXC(扬兴晶振); Symbol: Q22FA12800489; 3D Model: ff569852e08d42e6a0afc8f1b31cbda0; 3D Model Transform: 78.74,62.992,0,0,0,0,0,0,0; Add into BOM: yes; Normal temperature Frequency Tolerance: ±10ppm; Frequency Stability: ±20ppm; Load Capacitance: 8pF; Equivalent Series Resistance(ESR): 100Ω; Devices: [{"uuid":"248447dc42a31099","name":"OT201624MJBA4SL","source":""}]; Symbols: []; ModelName: CRYSTAL-SMD_4P-L2.0-W1.6-BL-A; Device: XL7EL89CKI-111YLC-24M; Supplier Part: C2965580; Value: 24MHz; Operating Temperature: -40℃~+85℃; LCSC Part Name: YSX211SL 24MHZ 8PF ±10PPM -40~85℃; Manufacturer Part: XL7EL89CKI-111YLC-24M; Supplier Footprint: SMD2016-4P; JLCPCB Part Class: Extended Part; Datasheet: https://item.szlcsc.com/datasheet/XL7EL89CKI-111YLC-24M/3357716.html; Supplier: LCSC; Convert to PCB: yes; Type: 贴片晶振; Footprints: []; FootprintName: osc-smd_4p-l2.0-w1.6-bl